# Altium project 7-segment.PrjPcb
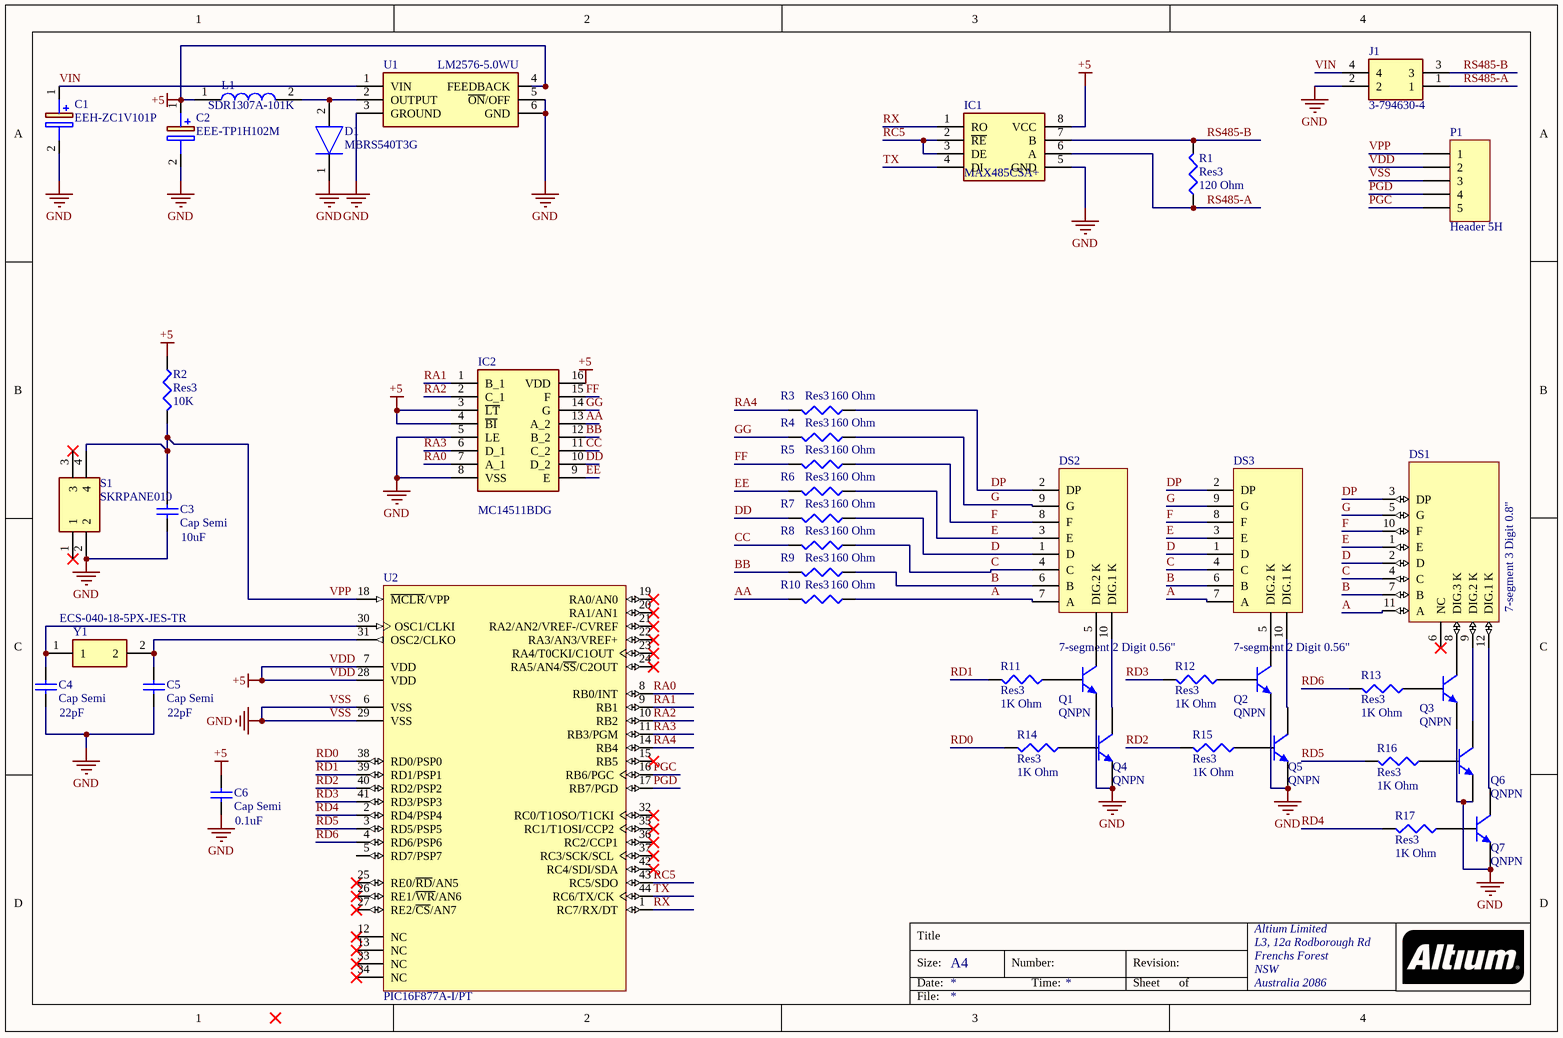
[diagram p0: 7-segmentSchematic.SchDoc]
1 sheet, 43 parts. Net scope: global (net labels, ports and power ports of the same name join across sheets).
Board file: 7-segmentPCB.PcbDoc

## Sheet 7-segmentSchematic.SchDoc
size A4; Organization: Altium Limited; Address1: L3, 12a Rodborough Rd; Address2: Frenchs Forest; Address3: NSW; Address4: Australia 2086

### Parts
C1  EEH-ZC1V101P  [CAPAE830X1050N]
C2  EEE-TP1H102M  [CAPAE1900X1700N]
C3  Cap Semi  value 10uF  [C1206]
C4  Cap Semi  value 22pF  [C1206]
C5  Cap Semi  value 22pF  [C1206]
C6  Cap Semi  value 0.1uF  [C1206]
D1  MBRS540T3G  [DIOM7958X256N]
DS1  7-segment 3 Digit 0.8"  [7-segment 3Digit]
DS2  7-segment 2 Digit 0.56"  [7-segment 2Digit]
DS3  7-segment 2 Digit 0.56"  [7-segment 2Digit]
IC1  MAX485CSA+  [SOIC127P600X175-8N]
IC2  MC14511BDG  [SOIC127P600X175-16N]
J1  3-794630-4  [37946304]
L1  SDR1307A-101K  [SDR1307A101K]
P1  Header 5H  [HDR1X5H]
Q1  QNPN  [SOT-23B_L]
Q2  QNPN  [SOT-23B_L]
Q3  QNPN  [SOT-23B_L]
Q4  QNPN  [SOT-23B_L]
Q5  QNPN  [SOT-23B_L]
Q6  QNPN  [SOT-23B_L]
Q7  QNPN  [SOT-23B_L]
R1  Res3  value 120 Ohm  [J1-0603]
R2  Res3  value 10K  [J1-0603]
R3  Res3  value 160 Ohm  [12Z-2010]
R4  Res3  value 160 Ohm  [12Z-2010]
R5  Res3  value 160 Ohm  [12Z-2010]
R6  Res3  value 160 Ohm  [12Z-2010]
R7  Res3  value 160 Ohm  [12Z-2010]
R8  Res3  value 160 Ohm  [12Z-2010]
R9  Res3  value 160 Ohm  [12Z-2010]
R10  Res3  value 160 Ohm  [12Z-2010]
R11  Res3  value 1K Ohm  [J1-0603]
R12  Res3  value 1K Ohm  [J1-0603]
R13  Res3  value 1K Ohm  [J1-0603]
R14  Res3  value 1K Ohm  [J1-0603]
R15  Res3  value 1K Ohm  [J1-0603]
R16  Res3  value 1K Ohm  [J1-0603]
R17  Res3  value 1K Ohm  [J1-0603]
S1  SKRPANE010  [SKRPADE010]
U1  LM2576-5.0WU  [MICROCHIP_TO-263]
U2  PIC16F877A-I/PT  [TQFP-PT44_N]
Y1  ECS-040-18-5PX-JES-TR  [ECS49205PXTR]

### Nets
VDD: C2.1(+) C6.2 IC1.8(VCC) IC2.3(~{LT}) IC2.4(~{BI}) IC2.16(VDD) L1.1 P1.2 R2.1 U1.4(FEEDBACK) U2.7(VDD) U2.28(VDD)  [also labelled +5]
VSS: C1.2(-) C2.2(-) C3.1 C4.1 C5.1 C6.1 D1.1(K) IC1.5(GND) IC2.5(LE) IC2.8(VSS) J1.2 P1.3 Q1.3(E) Q2.3(E) Q3.3(E) Q4.3(E) Q5.3(E) Q6.3(E) Q7.3(E) S1.2 U1.3(GROUND) U1.5(~{ON}/OFF) U1.6(GND) U2.6(VSS) U2.29(VSS)  [also labelled GND]
A: DS1.11(A) DS2.7(A) DS3.7(A) R10.1
AA: IC2.13(A_2) R10.2
B: DS1.7(B) DS2.6(B) DS3.6(B) R9.1
BB: IC2.12(B_2) R9.2
C: DS1.4(C) DS2.4(C) DS3.4(C) R8.1
CC: IC2.11(C_2) R8.2
D: DS1.2(D) DS2.1(D) DS3.1(D) R7.1
DD: IC2.10(D_2) R7.2
DP: DS1.3(DP) DS2.2(DP) DS3.2(DP) R3.1
E: DS1.1(E) DS2.3(E) DS3.3(E) R6.1
EE: IC2.9(E) R6.2
F: DS1.10(F) DS2.8(F) DS3.8(F) R5.1
FF: IC2.15(F) R5.2
G: DS1.5(G) DS2.9(G) DS3.9(G) R4.1
GG: IC2.14(G) R4.2
PGC: P1.5 U2.16(RB6/PGC)
PGD: P1.4 U2.17(RB7/PGD)
RA0: IC2.7(A_1) U2.8(RB0/INT)
RA1: IC2.1(B_1) U2.9(RB1)
RA2: IC2.2(C_1) U2.10(RB2)
RA3: IC2.6(D_1) U2.11(RB3/PGM)
RA4: R3.2 U2.14(RB4)
RC5: IC1.2(~{RE}) IC1.3(DE) U2.43(RC5/SDO)
RD0: R14.2 U2.38(RD0/PSP0)
RD1: R11.2 U2.39(RD1/PSP1)
RD2: R15.2 U2.40(RD2/PSP2)
RD3: R12.2 U2.41(RD3/PSP3)
RD4: R17.2 U2.2(RD4/PSP4)
RD5: R16.2 U2.3(RD5/PSP5)
RD6: R13.2 U2.4(RD6/PSP6)
RS485-A: IC1.6(A) J1.1 R1.1
RS485-B: IC1.7(B) J1.3 R1.2
RX: IC1.1(RO) U2.1(RC7/RX/DT)
TX: IC1.4(DI) U2.44(RC6/TX/CK)
VIN: C1.1(+) J1.4 U1.1(VIN)
VPP: C3.2 P1.1 R2.2 S1.4 U2.18(~{MCLR}/VPP)
NetC4_2: C4.2 U2.30(OSC1/CLKI) Y1.1
NetC5_2: C5.2 U2.31(OSC2/CLKO) Y1.2
NetD1_2: D1.2(A) L1.2 U1.2(OUTPUT)
NetDS1_8: DS1.8(DIG.3_K) Q3.1(C)
NetDS1_9: DS1.9(DIG.2_K) Q6.1(C)
NetDS1_12: DS1.12(DIG.1_K) Q7.1(C)
NetDS2_5: DS2.5(DIG.2_K) Q1.1(C)
NetDS2_10: DS2.10(DIG.1_K) Q4.1(C)
NetDS3_5: DS3.5(DIG.2_K) Q2.1(C)
NetDS3_10: DS3.10(DIG.1_K) Q5.1(C)
NetQ1_2: Q1.2(B) R11.1
NetQ2_2: Q2.2(B) R12.1
NetQ3_2: Q3.2(B) R13.1
NetQ4_2: Q4.2(B) R14.1
NetQ5_2: Q5.2(B) R15.1
NetQ6_2: Q6.2(B) R16.1
NetQ7_2: Q7.2(B) R17.1

Not connected (* = marked no-connect by the designer): DS1 6(NC)*; S1 1* 3*; U2 5(RD7/PSP7) 12(NC)* 13(NC)* 15(RB5)* 19(RA0/AN0)* 20(RA1/AN1)* 21(RA2/AN2/VREF-/CVREF)* 22(RA3/AN3/VREF+)* 23(RA4/T0CKI/C1OUT)* 24(RA5/AN4/~{SS}/C2OUT)* 25(RE0/~{RD}/AN5)* 26(RE1/~{WR}/AN6)* 27(RE2/~{CS}/AN7)* 32(RC0/T1OSO/T1CKI)* 33(NC)* 34(NC)* 35(RC1/T1OSI/CCP2)* 36(RC2/CCP1)* 37(RC3/SCK/SCL)* 42(RC4/SDI/SDA)*

### Notes on the sheet
- Title
- Size:
- Date:
- A4
- Number:
- Time:
- Revision:
- Sheet
- of
- File:

### Library data of the parts
C1 = EEH-ZC1V101P: Capacitor Polarised; Manufacturer_Name: Panasonic; Datasheet Link: https://www.mouser.com/datasheet/2/315/ABA0000C1234-1218024.pdf; Height: 10.5mm; Manufacturer_Part_Number: EEH-ZC1V101P; Mouser Part Number: 667-EEH-ZC1V101P; Mouser Price/Stock: https://www.mouser.com/Search/Refine.aspx?Keyword=667-EEH-ZC1V101P
C2 = EEE-TP1H102M: Capacitor Polarised; Manufacturer_Name: Panasonic; Datasheet Link: https://industrial.panasonic.com/cdbs/www-data/pdf/RDE0000/RDE0000C1255.pdf; Height: 17mm; Manufacturer_Part_Number: EEE-TP1H102M; Mouser Part Number: 667-EEE-TP1H102M; Mouser Price/Stock: https://www.mouser.com/Search/Refine.aspx?Keyword=667-EEE-TP1H102M
C3-C6 = Cap Semi: Capacitor (Semiconductor SIM Model); Published: 8-Jun-2000; LatestRevisionDate: 29-May-2009; LatestRevisionNote: IPC-7351 Footprint Added.; PackageReference: C1206; Publisher: Altium Limited; PackageDescription: Chip Capacitor
D1 = MBRS540T3G: Diode; Manufacturer_Name: ON Semiconductor; Allied_Number: 70100196; Datasheet Link: http://www.onsemi.com/pub/Collateral/MBRS540T3-D.PDF; Height: 2.56mm; Manufacturer_Part_Number: MBRS540T3G; Mouser Part Number: 863-MBRS540T3G; Mouser Price/Stock: https://www.mouser.com/Search/Refine.aspx?Keyword=863-MBRS540T3G; RS Part Number: 6880512P; RS Price/Stock: http://uk.rs-online.com/web/p/products/6880512P; Allied Price/Stock: http://www.alliedelec.com/on-semiconductor-mbrs540t3g/70100196/
DS1 = 7-segment 3 Digit
DS2 DS3 = 7-segment 2 Digit
IC1 = MAX485CSA+: Integrated Circuit; Manufacturer_Name: Maxim Integrated; Datasheet Link: http://datasheets.maximintegrated.com/en/ds/MAX1487-MAX491.pdf; Height: 1.75mm; Manufacturer_Part_Number: MAX485CSA+; Mouser Part Number: 700-MAX485CSA; Mouser Price/Stock: https://www.mouser.com/Search/Refine.aspx?Keyword=700-MAX485CSA; RS Part Number: 5404564P; RS Price/Stock: http://uk.rs-online.com/web/p/products/5404564P
IC2 = MC14511BDG: Integrated Circuit; Manufacturer_Name: ON Semiconductor; Allied_Number: 70466283; Datasheet Link: http://www.onsemi.com/pub/Collateral/MC14511B-D.PDF; Height: 1.75mm; Manufacturer_Part_Number: MC14511BDG; Mouser Part Number: 863-MC14511BDG; Mouser Price/Stock: https://www.mouser.com/Search/Refine.aspx?Keyword=863-MC14511BDG; RS Part Number: 8063267P; RS Price/Stock: http://uk.rs-online.com/web/p/products/8063267P; Allied Price/Stock: http://www.alliedelec.com/on-semiconductor-mc14511bdg/70466283/
J1 = 3-794630-4: Connector; Manufacturer_Name: TE Connectivity; Allied_Number: 70285783; Datasheet Link: https://www.te.com/commerce/DocumentDelivery/DDEController?Action=showdoc&DocId=Customer+Drawing%7F794630%7FF2%7Fpdf%7FEnglish%7FENG_CD_794630_F2.pdf%7F3-794630-4; Height: 9.24mm; Manufacturer_Part_Number: 3-794630-4; Mouser Part Number: 571-3-794630-4; Mouser Price/Stock: https://www.mouser.com/Search/Refine.aspx?Keyword=571-3-794630-4; RS Part Number: 4959344P; RS Price/Stock: http://uk.rs-online.com/web/p/products/4959344P; Allied Price/Stock: https://www.alliedelec.com/teconnectivity-3-794630-4/70285783/
L1 = SDR1307A-101K: Inductor; Manufacturer_Name: Bourns; Datasheet Link: https://componentsearchengine.com/Datasheets/2/SDR1307A-101K.pdf; Height: 7mm; Manufacturer_Part_Number: SDR1307A-101K; Mouser Part Number: 652-SDR1307A-101K; Mouser Price/Stock: https://www.mouser.com/Search/Refine.aspx?Keyword=652-SDR1307A-101K
P1 = Header 5H: Header, 5-Pin, Right Angle; LatestRevisionDate: 17-Jul-2002; LatestRevisionNote: Re-released for DXP Platform.; Publisher: Altium Limited
Q1-Q7 = QNPN: NPN Bipolar Transistor; Published: 8-Jun-2000; LatestRevisionDate: 29-May-2009; LatestRevisionNote: IPC-7351 Footprint Added.; PackageVersion: Aug-1999; PackageReference: SOT-23B; Publisher: Altium Limited; PackageDescription: 3-Pin SOT-23 Package 0.95 mm Pitch, 2.4 mm Lead Span
R1-R17 = Res3: Resistor; Published: 8-Jun-2000; LatestRevisionDate: 29-May-2009; LatestRevisionNote: IPC-7351 Footprint Added.; PackageReference: J1-0603; Publisher: Altium Limited; PackageDescription: Chip Resistor
S1 = SKRPANE010: Switch; Manufacturer_Name: ALPS; Datasheet Link: https://www.alps.com/prod/info/E/HTML/Tact/SurfaceMount/SKRP/SKRPANE010.html; Height: 2mm; Manufacturer_Part_Number: SKRPANE010; Mouser Part Number: 688-SKRPANE010; Mouser Price/Stock: https://www.mouser.com/Search/Refine.aspx?Keyword=688-SKRPANE010
U1 = LM2576-5.0WU: Undefined or Miscellaneous; Manufacturer_Name: Microchip; Datasheet Link: http://ww1.microchip.com/downloads/en/DeviceDoc/lm2576.pdf; Manufacturer_Part_Number: LM2576-5.0WU; Mouser Part Number: 998-LM2576-5.0WU; RS Part Number: 9101925P; RS Price/Stock: http://uk.rs-online.com/web/p/products/9101925P
U2 = PIC16F877A-I/PT: Enhanced FLASH Microcontroller, 8K (x14-Bit words) FLASH, 368 Bytes RAM, 44-Pin TQFP, Standard VDD Range, Industrial Temperature; ComponentAvailability: Unknown. Contact manufacturer to determine status.; Published: 11-Oct-2004; LatestRevisionDate: 29-Jan-2009; LatestRevisionNote: Sch. layout revised. 3D Model Removed.; DatasheetVersion: revB, Oct-2003; PackageVersion: revBB, Aug-2009; PackageReference: TQFP-PT44; Publisher: Altium Limited; PackageDescription: 44-Lead Plastic Thin Quad Flatpack (PT) - 10x10x1mm Body, 2.00mm [TQFP]; Supplier 1: Digi-Key; Supplier Part Number 1: PIC16F877A-I/PT-ND; Supplier 2: Farnell; Supplier Part Number 2: 9761454; Supplier 3: Farnell; Supplier Part Number 3: 9771093; Supplier 4: Farnell; Supplier Part Number 4: 1528478; Code_JEDEC: MS-026; ComponentLink1Description: Datasheet; ComponentLink1URL: http://ww1.microchip.com/downloads/en/DeviceDoc/39582b.pdf; ComponentLink2Description: Packaging Specification; ComponentLink2URL: http://www.microchip.com/stellent/groups/techpub_sg/documents/packagingspec/en012702.pdf; ComponentLink3Description: Microchip.com Home; ComponentLink3URL: http://www.microchip.com/
Y1 = ECS-040-18-5PX-JES-TR: Crystal or Oscillator; Manufacturer_Name: ECS; Datasheet Link: https://ecsxtal.com/store/pdf/csm-7x.pdf; Height: 4.3mm; Manufacturer_Part_Number: ECS-040-18-5PX-JES-TR; Mouser Part Number: 520-040-18-5PX-JEST; Mouser Price/Stock: https://www.mouser.com/Search/Refine.aspx?Keyword=520-040-18-5PX-JEST